# EAGLE design MotionDetector (EAGLE 7.3.0)
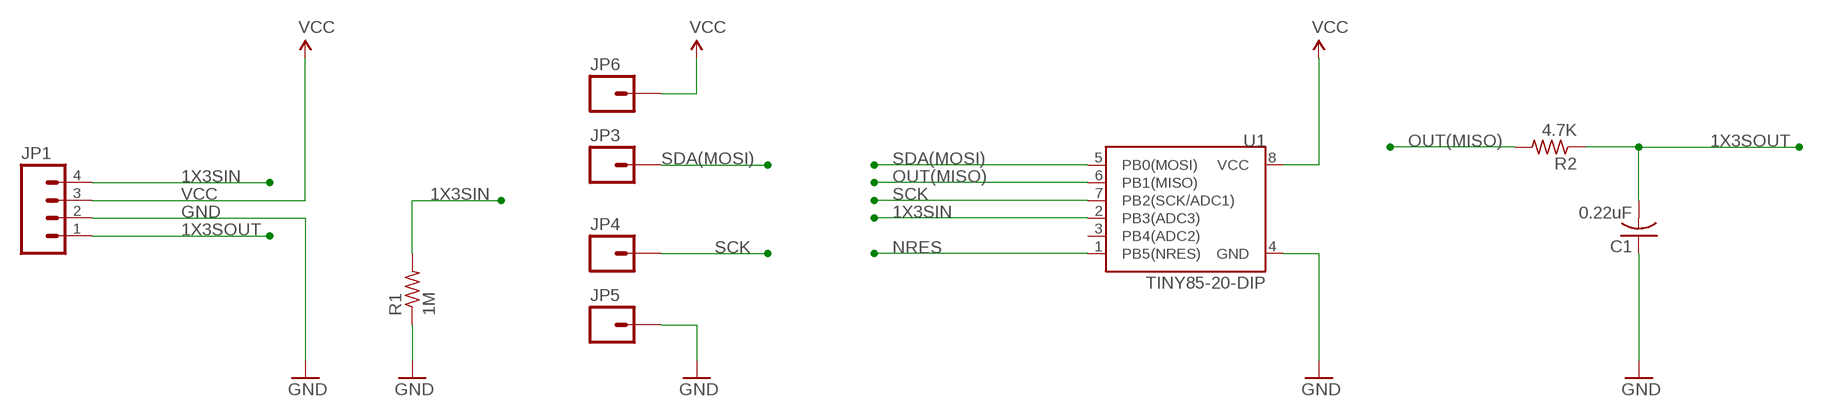
[diagram p0: schematic, sheet 1]

## Parts
C1  0.22uF  C-USC0402  [C0402]
JP1  M04PTH  [1X04]
JP3  M01PTH  [1X01]
JP4  M01PTH  [1X01]
JP5  M01PTH  [1X01]
JP6  M01PTH  [1X01]
R1  1M  R-US_R0603  [R0603]
R2  4.7K  R-US_R0603  [R0603]
U1  TINY85-20-DIP  ATTINY45TINY85-20-DIP  [DIP08]

## Nets
1X3SIN: JP1.4 R1.2 U1.2(PB3(ADC3))
1X3SOUT: C1.2 JP1.1 R2.1
GND: C1.1 JP1.2 JP5.1 R1.1 U1.4(GND)
NRES: U1.1(PB5(NRES))
OUT(MISO): R2.2 U1.6(PB1(MISO))
SCK: JP4.1 U1.7(PB2(SCK/ADC1))
SDA(MOSI): JP3.1 U1.5(PB0(MOSI))
VCC: JP1.3 JP6.1 U1.8(VCC)
Unconnected: U1.3(PB4(ADC2))

## Library data of the parts
C1 = adafruit:C-US: CAPACITOR, American symbol
JP1 = SparkFun-Connectors:M04: Header 4 Standard 4-pin 0.1" header. Use with straight break away headers (SKU : PRT-00116), right angle break away headers (PRT-00553), swiss pins (PRT-00743), machine pins (PRT-00117), and female headers (PRT-00115). Molex polarized connector foot print use with SKU : PRT-08231 with associated crimp pins and housings. 1MM SMD Version SKU: PRT-10208
JP3-JP6 = SparkFun-Connectors:M01: Header 1 Standard 1-pin 0.1" header. Use with straight break away headers (SKU : PRT-00116), right angle break away headers (PRT-00553), swiss pins (PRT-00743), machine pins (PRT-00117), and female headers (PRT-00115).
R1 R2 = adafruit:R-US_: RESISTOR, American symbol
U1 = SparkFun-DigitalIC:ATTINY45: Atmel 8-pin 2/4/8kB flash uC; PROD_ID: IC-09445

## Board
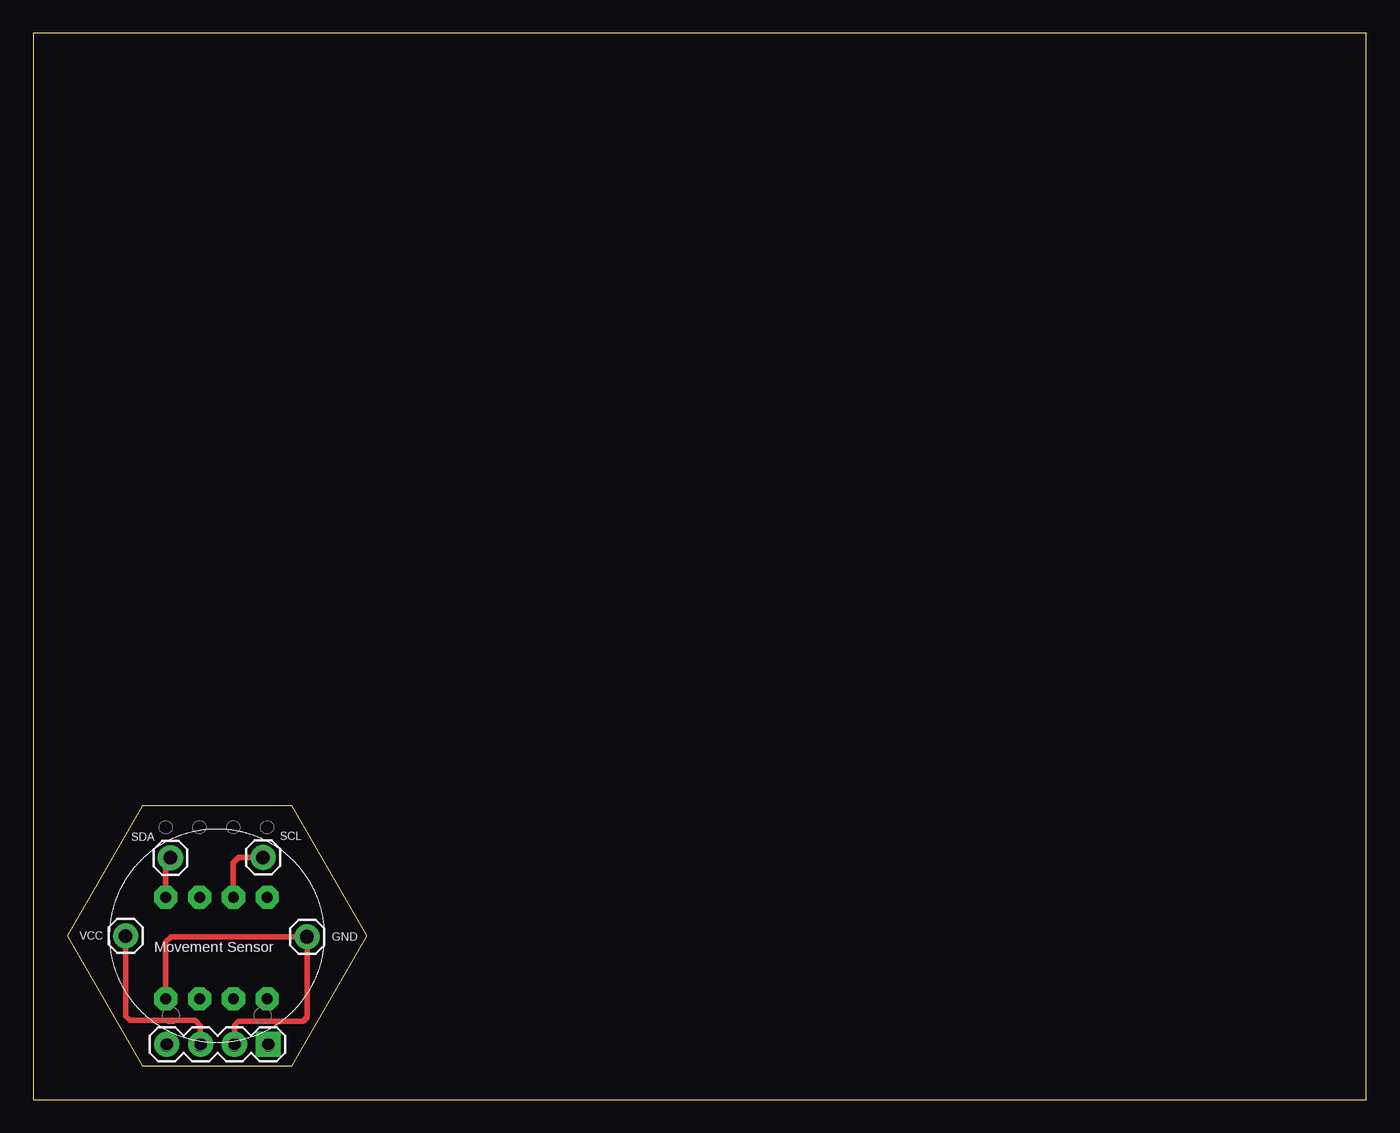
[diagram p1: board, top side]
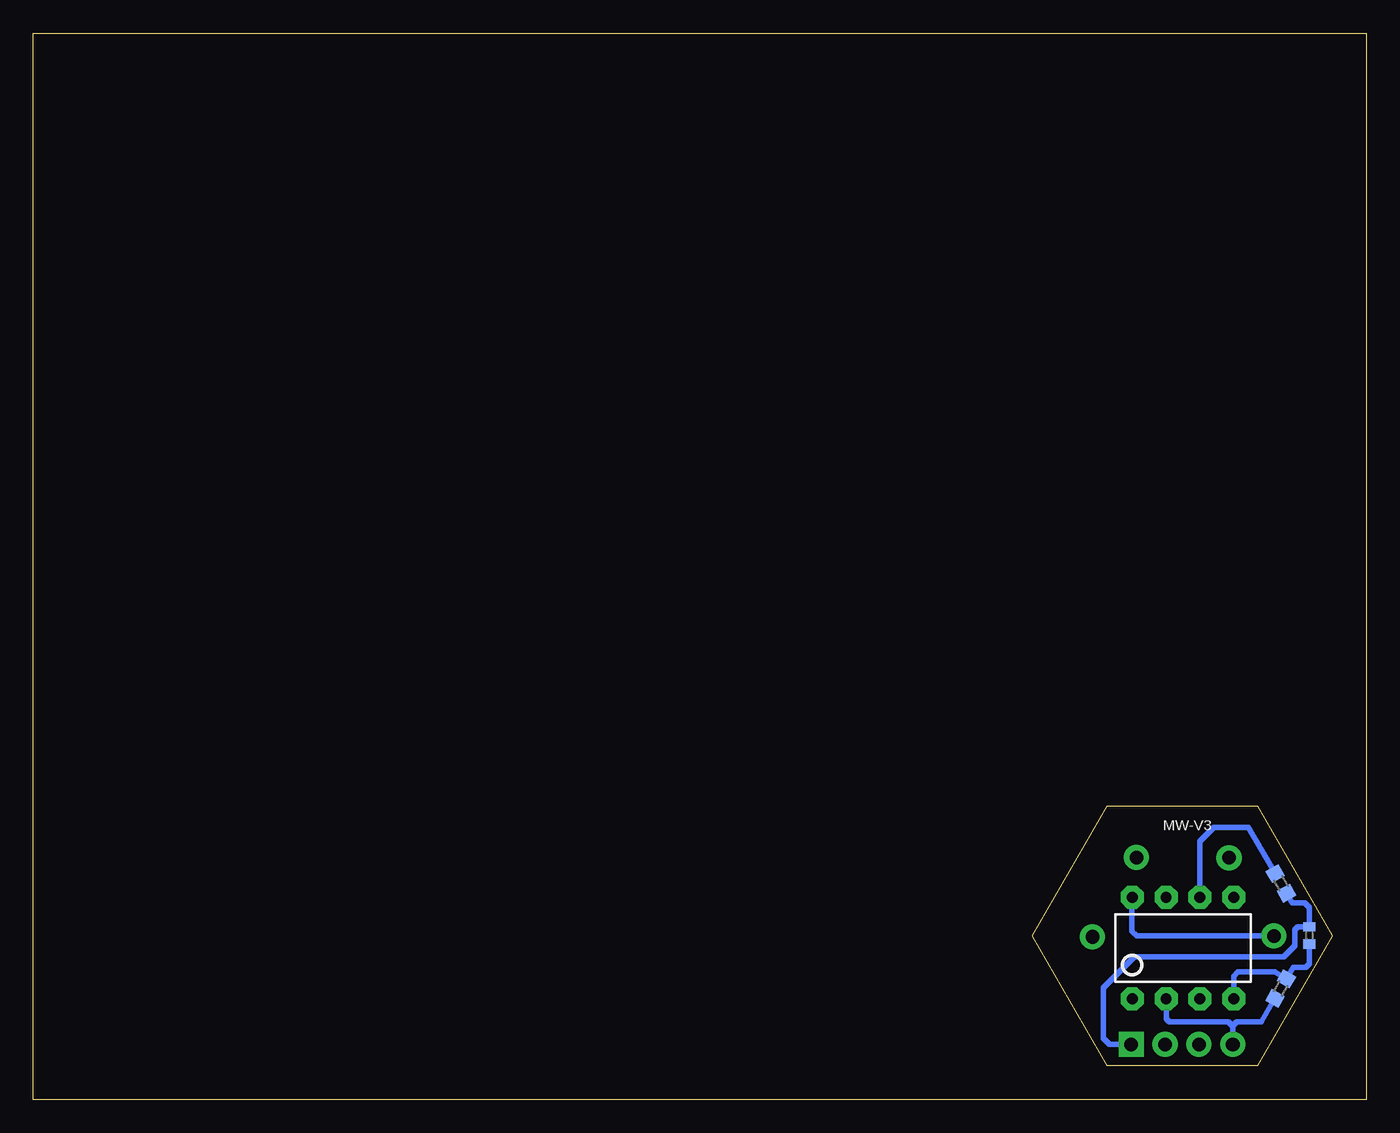
[diagram p2: board, bottom side, seen from below]

Size 100 x 80 mm. Coordinates in mm from the lower left corner, seen from the top.
Outline: 0,0 100,0 100,80 0,80 0,0
Outline: 8.16,2.55 19.41,2.55 25.03,12.29 19.41,22.03 8.16,22.03 2.53,12.29 8.16,2.55
Copper layers (1*16): Top 0.035mm / dielectric 1.5mm / Bottom 0.035mm
Design rules "default": minimum track width 10mil, minimum drill 24mil, track to track 8mil, track to pad 8mil, pad to pad 8mil, via to via 8mil, smd to smd 8mil, copper to edge 40mil, drill to drill 8mil, minimum pad ring 10mil, minimum via ring 8mil, stop-mask expansion 4mil, vias tented up to drill 0mil, thermal gap 10mil

### Footprints (pad centres in the part's own frame; a part is rotated, then mirrored left to right if it is on the bottom)
C0402 = smd 0.7 x 0.9: 1 -0.65,0; 2 0.65,0
1X04 = drill 1.016 pad 1.88 square: 1 0,0 | drill 1.016 pad 1.88: 2 2.54,0; 3 5.08,0; 4 7.62,0
1X01 = drill 1.016 pad 1.88: 1 0,0
R0603 = smd 1 x 1.1: 1 -0.85,0; 2 0.85,0
DIP08 = drill 0.813 pad 1.727 octagon: 1 -3.81,-3.81; 2 -1.27,-3.81; 3 1.27,-3.81; 4 3.81,-3.81; 5 3.81,3.81; 6 1.27,3.81; 7 -1.27,3.81; 8 -3.81,3.81

### Placement (x,y rotation side)
C1  4.25,12.31 90 bottom
JP1  17.63,4.14 180 top
JP3  10.29,18.14 0 top
JP4  17.23,18.16 0 top
JP5  20.54,12.2 0 top
JP6  6.92,12.27 0 top
R1  6.41,8.32 240 bottom
R2  6.4,16.22 120 bottom
U1  13.74,11.37 0 bottom

### Tracks (layer width: path | path; a pad name or v marks a point on that pad's centre or on a via)
1X3SIN
  Bottom 0.406: R1.2 7.86,5.82 9.72,5.82 10.01,5.52 JP1.4 10.01,5.5 10.35,5.84 14.77,5.84 15,6.07 15,7.54 U1.2
1X3SOUT
  Bottom 0.406: R2.1 5.55,14.74 4.6,14.74 4.25,14.4 C1.2 5.14,12.95 5.36,12.74 5.36,11.52 6.17,10.71 17.41,10.71 19.74,8.38 19.74,4.6 19.28,4.14 JP1.1
GND
  Top 0.406: U1.4 9.94,7.57 9.94,11.82 10.32,12.21 JP5.1 20.54,6.16 20.23,5.86 15.38,5.86 15.09,5.56 JP1.2
  Bottom 0.406: C1.1 4.25,10.19 4.53,9.91 5.46,9.91 R1.1 6.87,9.56 9.64,9.56 9.94,9.26 9.94,7.57 U1.4
OUT(MISO)
  Bottom 0.406: R2.2 8.83,20.42 11.42,20.42 12.47,19.37 U1.6
SCK
  Top 0.406: JP4.1 15.42,18.16 15.01,17.75 U1.7
SDA(MOSI)
  Top 0.406: U1.5 9.93,17.78 JP3.1
VCC
  Top 0.406: JP6.1 6.92,6.26 7.25,5.93 12.13,5.93 12.52,5.54 12.52,4.17 JP1.3
  Bottom 0.406: JP6.1 17.22,12.27 17.58,12.62 17.58,15.15 U1.8

### Text on the board
tPlace: SDA | SCL | VCC | GND | Movement Sensor
bPlace: MW-V3